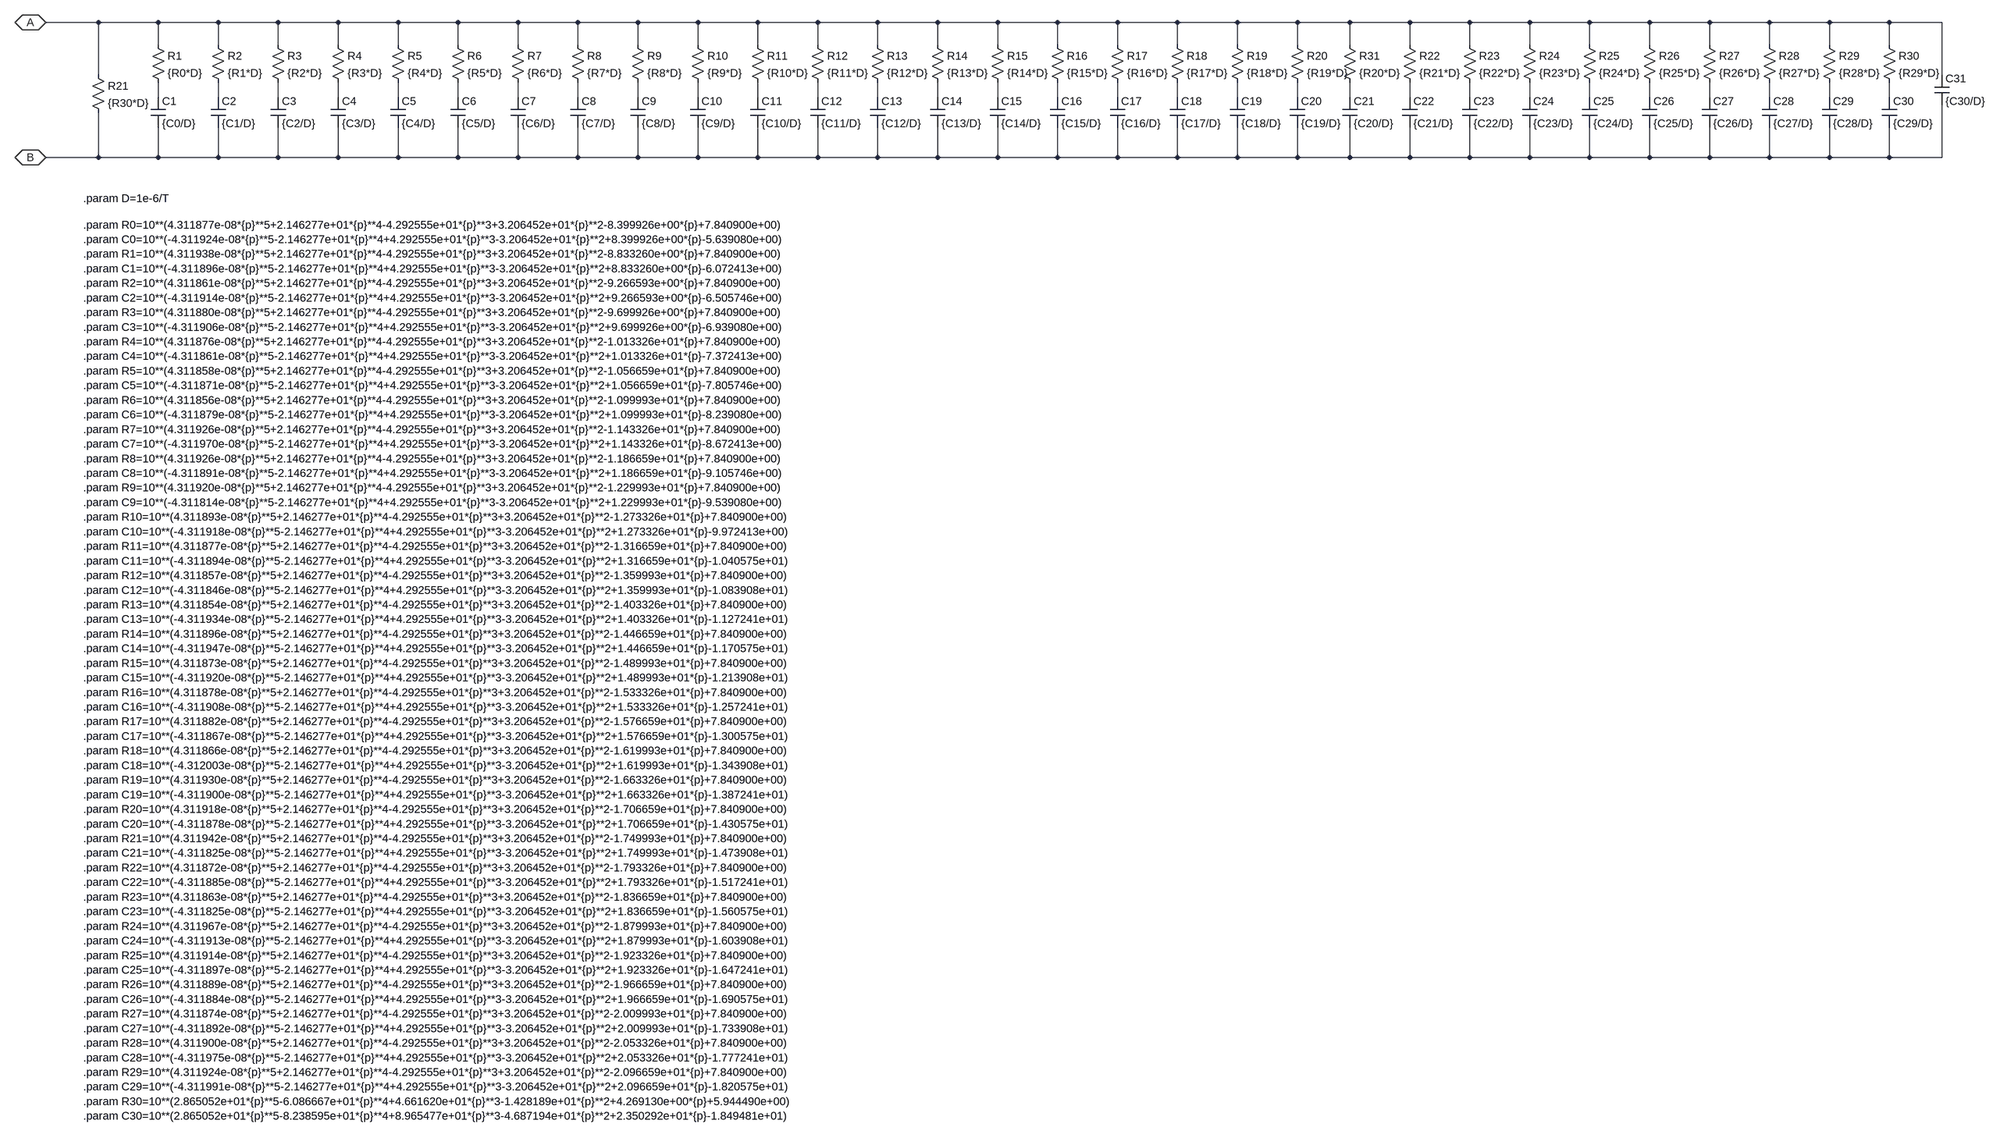
[diagram p0: schematic CPE_0.001_to_10e9.asc]
CPE_0.001_to_10e9.asc, the LTspice schematic file:
Version 4
SHEET 1 2676 1292
WIRE -1376 -864 -1488 -864
WIRE -1248 -864 -1376 -864
WIRE -1120 -864 -1248 -864
WIRE -992 -864 -1120 -864
WIRE -864 -864 -992 -864
WIRE -736 -864 -864 -864
WIRE -608 -864 -736 -864
WIRE -480 -864 -608 -864
WIRE -352 -864 -480 -864
WIRE -224 -864 -352 -864
WIRE -96 -864 -224 -864
WIRE 32 -864 -96 -864
WIRE 160 -864 32 -864
WIRE 288 -864 160 -864
WIRE 416 -864 288 -864
WIRE 544 -864 416 -864
WIRE 672 -864 544 -864
WIRE 800 -864 672 -864
WIRE 928 -864 800 -864
WIRE 1056 -864 928 -864
WIRE 1184 -864 1056 -864
WIRE 1296 -864 1184 -864
WIRE 1424 -864 1296 -864
WIRE 1552 -864 1424 -864
WIRE 1680 -864 1552 -864
WIRE 1808 -864 1680 -864
WIRE 1936 -864 1808 -864
WIRE 2064 -864 1936 -864
WIRE 2192 -864 2064 -864
WIRE 2320 -864 2192 -864
WIRE 2448 -864 2320 -864
WIRE 2560 -864 2448 -864
WIRE -1248 -816 -1248 -864
WIRE -1120 -816 -1120 -864
WIRE -992 -816 -992 -864
WIRE -864 -816 -864 -864
WIRE -736 -816 -736 -864
WIRE -608 -816 -608 -864
WIRE -480 -816 -480 -864
WIRE -352 -816 -352 -864
WIRE -224 -816 -224 -864
WIRE -96 -816 -96 -864
WIRE 32 -816 32 -864
WIRE 160 -816 160 -864
WIRE 288 -816 288 -864
WIRE 416 -816 416 -864
WIRE 544 -816 544 -864
WIRE 672 -816 672 -864
WIRE 800 -816 800 -864
WIRE 928 -816 928 -864
WIRE 1056 -816 1056 -864
WIRE 1184 -816 1184 -864
WIRE 1296 -816 1296 -864
WIRE 1424 -816 1424 -864
WIRE 1552 -816 1552 -864
WIRE 1680 -816 1680 -864
WIRE 1808 -816 1808 -864
WIRE 1936 -816 1936 -864
WIRE 2064 -816 2064 -864
WIRE 2192 -816 2192 -864
WIRE 2320 -816 2320 -864
WIRE 2448 -816 2448 -864
WIRE -1376 -752 -1376 -864
WIRE 2560 -752 2560 -864
WIRE -1248 -704 -1248 -736
WIRE -1120 -704 -1120 -736
WIRE -992 -704 -992 -736
WIRE -864 -704 -864 -736
WIRE -736 -704 -736 -736
WIRE -608 -704 -608 -736
WIRE -480 -704 -480 -736
WIRE -352 -704 -352 -736
WIRE -224 -704 -224 -736
WIRE -96 -704 -96 -736
WIRE 32 -704 32 -736
WIRE 160 -704 160 -736
WIRE 288 -704 288 -736
WIRE 416 -704 416 -736
WIRE 544 -704 544 -736
WIRE 672 -704 672 -736
WIRE 800 -704 800 -736
WIRE 928 -704 928 -736
WIRE 1056 -704 1056 -736
WIRE 1184 -704 1184 -736
WIRE 1296 -704 1296 -736
WIRE 1424 -704 1424 -736
WIRE 1552 -704 1552 -736
WIRE 1680 -704 1680 -736
WIRE 1808 -704 1808 -736
WIRE 1936 -704 1936 -736
WIRE 2064 -704 2064 -736
WIRE 2192 -704 2192 -736
WIRE 2320 -704 2320 -736
WIRE 2448 -704 2448 -736
WIRE -1376 -576 -1376 -672
WIRE -1376 -576 -1488 -576
WIRE -1248 -576 -1248 -640
WIRE -1248 -576 -1376 -576
WIRE -1120 -576 -1120 -640
WIRE -1120 -576 -1248 -576
WIRE -992 -576 -992 -640
WIRE -992 -576 -1120 -576
WIRE -864 -576 -864 -640
WIRE -864 -576 -992 -576
WIRE -736 -576 -736 -640
WIRE -736 -576 -864 -576
WIRE -608 -576 -608 -640
WIRE -608 -576 -736 -576
WIRE -480 -576 -480 -640
WIRE -480 -576 -608 -576
WIRE -352 -576 -352 -640
WIRE -352 -576 -480 -576
WIRE -224 -576 -224 -640
WIRE -224 -576 -352 -576
WIRE -96 -576 -96 -640
WIRE -96 -576 -224 -576
WIRE 32 -576 32 -640
WIRE 32 -576 -96 -576
WIRE 160 -576 160 -640
WIRE 160 -576 32 -576
WIRE 288 -576 288 -640
WIRE 288 -576 160 -576
WIRE 416 -576 416 -640
WIRE 416 -576 288 -576
WIRE 544 -576 544 -640
WIRE 544 -576 416 -576
WIRE 672 -576 672 -640
WIRE 672 -576 544 -576
WIRE 800 -576 800 -640
WIRE 800 -576 672 -576
WIRE 928 -576 928 -640
WIRE 928 -576 800 -576
WIRE 1056 -576 1056 -640
WIRE 1056 -576 928 -576
WIRE 1184 -576 1184 -640
WIRE 1184 -576 1056 -576
WIRE 1296 -576 1296 -640
WIRE 1296 -576 1184 -576
WIRE 1424 -576 1424 -640
WIRE 1424 -576 1296 -576
WIRE 1552 -576 1552 -640
WIRE 1552 -576 1424 -576
WIRE 1680 -576 1680 -640
WIRE 1680 -576 1552 -576
WIRE 1808 -576 1808 -640
WIRE 1808 -576 1680 -576
WIRE 1936 -576 1936 -640
WIRE 1936 -576 1808 -576
WIRE 2064 -576 2064 -640
WIRE 2064 -576 1936 -576
WIRE 2192 -576 2192 -640
WIRE 2192 -576 2064 -576
WIRE 2320 -576 2320 -640
WIRE 2320 -576 2192 -576
WIRE 2448 -576 2448 -640
WIRE 2448 -576 2320 -576
WIRE 2560 -576 2560 -688
WIRE 2560 -576 2448 -576
FLAG -1488 -576 B
IOPIN -1488 -576 BiDir
FLAG -1488 -864 A
IOPIN -1488 -864 BiDir
SYMBOL cap -1264 -704 R0
SYMATTR InstName C1
SYMATTR Value {C0/D}
SYMBOL res -1264 -832 R0
SYMATTR InstName R1
SYMATTR Value {R0*D}
SYMBOL cap -1136 -704 R0
SYMATTR InstName C2
SYMATTR Value {C1/D}
SYMBOL res -1136 -832 R0
SYMATTR InstName R2
SYMATTR Value {R1*D}
SYMBOL cap -1008 -704 R0
SYMATTR InstName C3
SYMATTR Value {C2/D}
SYMBOL res -1008 -832 R0
SYMATTR InstName R3
SYMATTR Value {R2*D}
SYMBOL cap -880 -704 R0
SYMATTR InstName C4
SYMATTR Value {C3/D}
SYMBOL res -880 -832 R0
SYMATTR InstName R4
SYMATTR Value {R3*D}
SYMBOL cap -752 -704 R0
SYMATTR InstName C5
SYMATTR Value {C4/D}
SYMBOL res -752 -832 R0
SYMATTR InstName R5
SYMATTR Value {R4*D}
SYMBOL cap -624 -704 R0
SYMATTR InstName C6
SYMATTR Value {C5/D}
SYMBOL res -624 -832 R0
SYMATTR InstName R6
SYMATTR Value {R5*D}
SYMBOL cap -496 -704 R0
SYMATTR InstName C7
SYMATTR Value {C6/D}
SYMBOL res -496 -832 R0
SYMATTR InstName R7
SYMATTR Value {R6*D}
SYMBOL cap -368 -704 R0
SYMATTR InstName C8
SYMATTR Value {C7/D}
SYMBOL res -368 -832 R0
SYMATTR InstName R8
SYMATTR Value {R7*D}
SYMBOL cap -240 -704 R0
SYMATTR InstName C9
SYMATTR Value {C8/D}
SYMBOL res -240 -832 R0
SYMATTR InstName R9
SYMATTR Value {R8*D}
SYMBOL cap -112 -704 R0
SYMATTR InstName C10
SYMATTR Value {C9/D}
SYMBOL res -112 -832 R0
SYMATTR InstName R10
SYMATTR Value {R9*D}
SYMBOL cap 16 -704 R0
SYMATTR InstName C11
SYMATTR Value {C10/D}
SYMBOL res 16 -832 R0
SYMATTR InstName R11
SYMATTR Value {R10*D}
SYMBOL cap 144 -704 R0
SYMATTR InstName C12
SYMATTR Value {C11/D}
SYMBOL res 144 -832 R0
SYMATTR InstName R12
SYMATTR Value {R11*D}
SYMBOL cap 272 -704 R0
SYMATTR InstName C13
SYMATTR Value {C12/D}
SYMBOL res 272 -832 R0
SYMATTR InstName R13
SYMATTR Value {R12*D}
SYMBOL cap 400 -704 R0
SYMATTR InstName C14
SYMATTR Value {C13/D}
SYMBOL res 400 -832 R0
SYMATTR InstName R14
SYMATTR Value {R13*D}
SYMBOL cap 528 -704 R0
SYMATTR InstName C15
SYMATTR Value {C14/D}
SYMBOL res 528 -832 R0
SYMATTR InstName R15
SYMATTR Value {R14*D}
SYMBOL cap 656 -704 R0
SYMATTR InstName C16
SYMATTR Value {C15/D}
SYMBOL res 656 -832 R0
SYMATTR InstName R16
SYMATTR Value {R15*D}
SYMBOL cap 784 -704 R0
SYMATTR InstName C17
SYMATTR Value {C16/D}
SYMBOL res 784 -832 R0
SYMATTR InstName R17
SYMATTR Value {R16*D}
SYMBOL cap 912 -704 R0
SYMATTR InstName C18
SYMATTR Value {C17/D}
SYMBOL res 912 -832 R0
SYMATTR InstName R18
SYMATTR Value {R17*D}
SYMBOL cap 1040 -704 R0
SYMATTR InstName C19
SYMATTR Value {C18/D}
SYMBOL res 1040 -832 R0
SYMATTR InstName R19
SYMATTR Value {R18*D}
SYMBOL cap 1168 -704 R0
SYMATTR InstName C20
SYMATTR Value {C19/D}
SYMBOL res 1168 -832 R0
SYMATTR InstName R20
SYMATTR Value {R19*D}
SYMBOL res -1392 -768 R0
SYMATTR InstName R21
SYMATTR Value {R30*D}
SYMBOL cap 1408 -704 R0
SYMATTR InstName C22
SYMATTR Value {C21/D}
SYMBOL res 1408 -832 R0
SYMATTR InstName R22
SYMATTR Value {R21*D}
SYMBOL cap 1536 -704 R0
SYMATTR InstName C23
SYMATTR Value {C22/D}
SYMBOL res 1536 -832 R0
SYMATTR InstName R23
SYMATTR Value {R22*D}
SYMBOL cap 1664 -704 R0
SYMATTR InstName C24
SYMATTR Value {C23/D}
SYMBOL res 1664 -832 R0
SYMATTR InstName R24
SYMATTR Value {R23*D}
SYMBOL cap 1792 -704 R0
SYMATTR InstName C25
SYMATTR Value {C24/D}
SYMBOL res 1792 -832 R0
SYMATTR InstName R25
SYMATTR Value {R24*D}
SYMBOL cap 1920 -704 R0
SYMATTR InstName C26
SYMATTR Value {C25/D}
SYMBOL res 1920 -832 R0
SYMATTR InstName R26
SYMATTR Value {R25*D}
SYMBOL cap 2048 -704 R0
SYMATTR InstName C27
SYMATTR Value {C26/D}
SYMBOL res 2048 -832 R0
SYMATTR InstName R27
SYMATTR Value {R26*D}
SYMBOL cap 2176 -704 R0
SYMATTR InstName C28
SYMATTR Value {C27/D}
SYMBOL res 2176 -832 R0
SYMATTR InstName R28
SYMATTR Value {R27*D}
SYMBOL cap 2304 -704 R0
SYMATTR InstName C29
SYMATTR Value {C28/D}
SYMBOL res 2304 -832 R0
SYMATTR InstName R29
SYMATTR Value {R28*D}
SYMBOL cap 2432 -704 R0
SYMATTR InstName C30
SYMATTR Value {C29/D}
SYMBOL res 2432 -832 R0
SYMATTR InstName R30
SYMATTR Value {R29*D}
SYMBOL cap 2544 -752 R0
SYMATTR InstName C31
SYMATTR Value {C30/D}
SYMBOL cap 1280 -704 R0
SYMATTR InstName C21
SYMATTR Value {C20/D}
SYMBOL res 1280 -832 R0
SYMATTR InstName R31
SYMATTR Value {R20*D}
TEXT -1408 -488 Left 2 !.param D=1e-6/T
TEXT -1408 -432 Left 2 !.param R0=10**(4.311877e-08*{p}**5+2.146277e+01*{p}**4-4.292555e+01*{p}**3+3.206452e+01*{p}**2-8.399926e+00*{p}+7.840900e+00)\n.param C0=10**(-4.311924e-08*{p}**5-2.146277e+01*{p}**4+4.292555e+01*{p}**3-3.206452e+01*{p}**2+8.399926e+00*{p}-5.639080e+00)\n.param R1=10**(4.311938e-08*{p}**5+2.146277e+01*{p}**4-4.292555e+01*{p}**3+3.206452e+01*{p}**2-8.833260e+00*{p}+7.840900e+00)\n.param C1=10**(-4.311896e-08*{p}**5-2.146277e+01*{p}**4+4.292555e+01*{p}**3-3.206452e+01*{p}**2+8.833260e+00*{p}-6.072413e+00)\n.param R2=10**(4.311861e-08*{p}**5+2.146277e+01*{p}**4-4.292555e+01*{p}**3+3.206452e+01*{p}**2-9.266593e+00*{p}+7.840900e+00)\n.param C2=10**(-4.311914e-08*{p}**5-2.146277e+01*{p}**4+4.292555e+01*{p}**3-3.206452e+01*{p}**2+9.266593e+00*{p}-6.505746e+00)\n.param R3=10**(4.311880e-08*{p}**5+2.146277e+01*{p}**4-4.292555e+01*{p}**3+3.206452e+01*{p}**2-9.699926e+00*{p}+7.840900e+00)\n.param C3=10**(-4.311906e-08*{p}**5-2.146277e+01*{p}**4+4.292555e+01*{p}**3-3.206452e+01*{p}**2+9.699926e+00*{p}-6.939080e+00)\n.param R4=10**(4.311876e-08*{p}**5+2.146277e+01*{p}**4-4.292555e+01*{p}**3+3.206452e+01*{p}**2-1.013326e+01*{p}+7.840900e+00)\n.param C4=10**(-4.311861e-08*{p}**5-2.146277e+01*{p}**4+4.292555e+01*{p}**3-3.206452e+01*{p}**2+1.013326e+01*{p}-7.372413e+00)\n.param R5=10**(4.311858e-08*{p}**5+2.146277e+01*{p}**4-4.292555e+01*{p}**3+3.206452e+01*{p}**2-1.056659e+01*{p}+7.840900e+00)\n.param C5=10**(-4.311871e-08*{p}**5-2.146277e+01*{p}**4+4.292555e+01*{p}**3-3.206452e+01*{p}**2+1.056659e+01*{p}-7.805746e+00)\n.param R6=10**(4.311856e-08*{p}**5+2.146277e+01*{p}**4-4.292555e+01*{p}**3+3.206452e+01*{p}**2-1.099993e+01*{p}+7.840900e+00)\n.param C6=10**(-4.311879e-08*{p}**5-2.146277e+01*{p}**4+4.292555e+01*{p}**3-3.206452e+01*{p}**2+1.099993e+01*{p}-8.239080e+00)\n.param R7=10**(4.311926e-08*{p}**5+2.146277e+01*{p}**4-4.292555e+01*{p}**3+3.206452e+01*{p}**2-1.143326e+01*{p}+7.840900e+00)\n.param C7=10**(-4.311970e-08*{p}**5-2.146277e+01*{p}**4+4.292555e+01*{p}**3-3.206452e+01*{p}**2+1.143326e+01*{p}-8.672413e+00)\n.param R8=10**(4.311926e-08*{p}**5+2.146277e+01*{p}**4-4.292555e+01*{p}**3+3.206452e+01*{p}**2-1.186659e+01*{p}+7.840900e+00)\n.param C8=10**(-4.311891e-08*{p}**5-2.146277e+01*{p}**4+4.292555e+01*{p}**3-3.206452e+01*{p}**2+1.186659e+01*{p}-9.105746e+00)\n.param R9=10**(4.311920e-08*{p}**5+2.146277e+01*{p}**4-4.292555e+01*{p}**3+3.206452e+01*{p}**2-1.229993e+01*{p}+7.840900e+00)\n.param C9=10**(-4.311814e-08*{p}**5-2.146277e+01*{p}**4+4.292555e+01*{p}**3-3.206452e+01*{p}**2+1.229993e+01*{p}-9.539080e+00)\n.param R10=10**(4.311893e-08*{p}**5+2.146277e+01*{p}**4-4.292555e+01*{p}**3+3.206452e+01*{p}**2-1.273326e+01*{p}+7.840900e+00)\n.param C10=10**(-4.311918e-08*{p}**5-2.146277e+01*{p}**4+4.292555e+01*{p}**3-3.206452e+01*{p}**2+1.273326e+01*{p}-9.972413e+00)\n.param R11=10**(4.311877e-08*{p}**5+2.146277e+01*{p}**4-4.292555e+01*{p}**3+3.206452e+01*{p}**2-1.316659e+01*{p}+7.840900e+00)\n.param C11=10**(-4.311894e-08*{p}**5-2.146277e+01*{p}**4+4.292555e+01*{p}**3-3.206452e+01*{p}**2+1.316659e+01*{p}-1.040575e+01)\n.param R12=10**(4.311857e-08*{p}**5+2.146277e+01*{p}**4-4.292555e+01*{p}**3+3.206452e+01*{p}**2-1.359993e+01*{p}+7.840900e+00)\n.param C12=10**(-4.311846e-08*{p}**5-2.146277e+01*{p}**4+4.292555e+01*{p}**3-3.206452e+01*{p}**2+1.359993e+01*{p}-1.083908e+01)\n.param R13=10**(4.311854e-08*{p}**5+2.146277e+01*{p}**4-4.292555e+01*{p}**3+3.206452e+01*{p}**2-1.403326e+01*{p}+7.840900e+00)\n.param C13=10**(-4.311934e-08*{p}**5-2.146277e+01*{p}**4+4.292555e+01*{p}**3-3.206452e+01*{p}**2+1.403326e+01*{p}-1.127241e+01)\n.param R14=10**(4.311896e-08*{p}**5+2.146277e+01*{p}**4-4.292555e+01*{p}**3+3.206452e+01*{p}**2-1.446659e+01*{p}+7.840900e+00)\n.param C14=10**(-4.311947e-08*{p}**5-2.146277e+01*{p}**4+4.292555e+01*{p}**3-3.206452e+01*{p}**2+1.446659e+01*{p}-1.170575e+01)\n.param R15=10**(4.311873e-08*{p}**5+2.146277e+01*{p}**4-4.292555e+01*{p}**3+3.206452e+01*{p}**2-1.489993e+01*{p}+7.840900e+00)\n.param C15=10**(-4.311920e-08*{p}**5-2.146277e+01*{p}**4+4.292555e+01*{p}**3-3.206452e+01*{p}**2+1.489993e+01*{p}-1.213908e+01)\n.param R16=10**(4.311878e-08*{p}**5+2.146277e+01*{p}**4-4.292555e+01*{p}**3+3.206452e+01*{p}**2-1.533326e+01*{p}+7.840900e+00)\n.param C16=10**(-4.311908e-08*{p}**5-2.146277e+01*{p}**4+4.292555e+01*{p}**3-3.206452e+01*{p}**2+1.533326e+01*{p}-1.257241e+01)\n.param R17=10**(4.311882e-08*{p}**5+2.146277e+01*{p}**4-4.292555e+01*{p}**3+3.206452e+01*{p}**2-1.576659e+01*{p}+7.840900e+00)\n.param C17=10**(-4.311867e-08*{p}**5-2.146277e+01*{p}**4+4.292555e+01*{p}**3-3.206452e+01*{p}**2+1.576659e+01*{p}-1.300575e+01)\n.param R18=10**(4.311866e-08*{p}**5+2.146277e+01*{p}**4-4.292555e+01*{p}**3+3.206452e+01*{p}**2-1.619993e+01*{p}+7.840900e+00)\n.param C18=10**(-4.312003e-08*{p}**5-2.146277e+01*{p}**4+4.292555e+01*{p}**3-3.206452e+01*{p}**2+1.619993e+01*{p}-1.343908e+01)\n.param R19=10**(4.311930e-08*{p}**5+2.146277e+01*{p}**4-4.292555e+01*{p}**3+3.206452e+01*{p}**2-1.663326e+01*{p}+7.840900e+00)\n.param C19=10**(-4.311900e-08*{p}**5-2.146277e+01*{p}**4+4.292555e+01*{p}**3-3.206452e+01*{p}**2+1.663326e+01*{p}-1.387241e+01)\n.param R20=10**(4.311918e-08*{p}**5+2.146277e+01*{p}**4-4.292555e+01*{p}**3+3.206452e+01*{p}**2-1.706659e+01*{p}+7.840900e+00)\n.param C20=10**(-4.311878e-08*{p}**5-2.146277e+01*{p}**4+4.292555e+01*{p}**3-3.206452e+01*{p}**2+1.706659e+01*{p}-1.430575e+01)\n.param R21=10**(4.311942e-08*{p}**5+2.146277e+01*{p}**4-4.292555e+01*{p}**3+3.206452e+01*{p}**2-1.749993e+01*{p}+7.840900e+00)\n.param C21=10**(-4.311825e-08*{p}**5-2.146277e+01*{p}**4+4.292555e+01*{p}**3-3.206452e+01*{p}**2+1.749993e+01*{p}-1.473908e+01)\n.param R22=10**(4.311872e-08*{p}**5+2.146277e+01*{p}**4-4.292555e+01*{p}**3+3.206452e+01*{p}**2-1.793326e+01*{p}+7.840900e+00)\n.param C22=10**(-4.311885e-08*{p}**5-2.146277e+01*{p}**4+4.292555e+01*{p}**3-3.206452e+01*{p}**2+1.793326e+01*{p}-1.517241e+01)\n.param R23=10**(4.311863e-08*{p}**5+2.146277e+01*{p}**4-4.292555e+01*{p}**3+3.206452e+01*{p}**2-1.836659e+01*{p}+7.840900e+00)\n.param C23=10**(-4.311825e-08*{p}**5-2.146277e+01*{p}**4+4.292555e+01*{p}**3-3.206452e+01*{p}**2+1.836659e+01*{p}-1.560575e+01)\n.param R24=10**(4.311967e-08*{p}**5+2.146277e+01*{p}**4-4.292555e+01*{p}**3+3.206452e+01*{p}**2-1.879993e+01*{p}+7.840900e+00)\n.param C24=10**(-4.311913e-08*{p}**5-2.146277e+01*{p}**4+4.292555e+01*{p}**3-3.206452e+01*{p}**2+1.879993e+01*{p}-1.603908e+01)\n.param R25=10**(4.311914e-08*{p}**5+2.146277e+01*{p}**4-4.292555e+01*{p}**3+3.206452e+01*{p}**2-1.923326e+01*{p}+7.840900e+00)\n.param C25=10**(-4.311897e-08*{p}**5-2.146277e+01*{p}**4+4.292555e+01*{p}**3-3.206452e+01*{p}**2+1.923326e+01*{p}-1.647241e+01)\n.param R26=10**(4.311889e-08*{p}**5+2.146277e+01*{p}**4-4.292555e+01*{p}**3+3.206452e+01*{p}**2-1.966659e+01*{p}+7.840900e+00)\n.param C26=10**(-4.311884e-08*{p}**5-2.146277e+01*{p}**4+4.292555e+01*{p}**3-3.206452e+01*{p}**2+1.966659e+01*{p}-1.690575e+01)\n.param R27=10**(4.311874e-08*{p}**5+2.146277e+01*{p}**4-4.292555e+01*{p}**3+3.206452e+01*{p}**2-2.009993e+01*{p}+7.840900e+00)\n.param C27=10**(-4.311892e-08*{p}**5-2.146277e+01*{p}**4+4.292555e+01*{p}**3-3.206452e+01*{p}**2+2.009993e+01*{p}-1.733908e+01)\n.param R28=10**(4.311900e-08*{p}**5+2.146277e+01*{p}**4-4.292555e+01*{p}**3+3.206452e+01*{p}**2-2.053326e+01*{p}+7.840900e+00)\n.param C28=10**(-4.311975e-08*{p}**5-2.146277e+01*{p}**4+4.292555e+01*{p}**3-3.206452e+01*{p}**2+2.053326e+01*{p}-1.777241e+01)\n.param R29=10**(4.311924e-08*{p}**5+2.146277e+01*{p}**4-4.292555e+01*{p}**3+3.206452e+01*{p}**2-2.096659e+01*{p}+7.840900e+00)\n.param C29=10**(-4.311991e-08*{p}**5-2.146277e+01*{p}**4+4.292555e+01*{p}**3-3.206452e+01*{p}**2+2.096659e+01*{p}-1.820575e+01)\n.param R30=10**(2.865052e+01*{p}**5-6.086667e+01*{p}**4+4.661620e+01*{p}**3-1.428189e+01*{p}**2+4.269130e+00*{p}+5.944490e+00)\n.param C30=10**(2.865052e+01*{p}**5-8.238595e+01*{p}**4+8.965477e+01*{p}**3-4.687194e+01*{p}**2+2.350292e+01*{p}-1.849481e+01)

The netlist it stands for:
* CPE_0.001_to_10e9.asc
C1 N001 B {C0/D}
R1 A N001 {R0*D}
C2 N002 B {C1/D}
R2 A N002 {R1*D}
C3 N003 B {C2/D}
R3 A N003 {R2*D}
C4 N004 B {C3/D}
R4 A N004 {R3*D}
C5 N005 B {C4/D}
R5 A N005 {R4*D}
C6 N006 B {C5/D}
R6 A N006 {R5*D}
C7 N007 B {C6/D}
R7 A N007 {R6*D}
C8 N008 B {C7/D}
R8 A N008 {R7*D}
C9 N009 B {C8/D}
R9 A N009 {R8*D}
C10 N010 B {C9/D}
R10 A N010 {R9*D}
C11 N011 B {C10/D}
R11 A N011 {R10*D}
C12 N012 B {C11/D}
R12 A N012 {R11*D}
C13 N013 B {C12/D}
R13 A N013 {R12*D}
C14 N014 B {C13/D}
R14 A N014 {R13*D}
C15 N015 B {C14/D}
R15 A N015 {R14*D}
C16 N016 B {C15/D}
R16 A N016 {R15*D}
C17 N017 B {C16/D}
R17 A N017 {R16*D}
C18 N018 B {C17/D}
R18 A N018 {R17*D}
C19 N019 B {C18/D}
R19 A N019 {R18*D}
C20 N020 B {C19/D}
R20 A N020 {R19*D}
R21 A B {R30*D}
C22 N022 B {C21/D}
R22 A N022 {R21*D}
C23 N023 B {C22/D}
R23 A N023 {R22*D}
C24 N024 B {C23/D}
R24 A N024 {R23*D}
C25 N025 B {C24/D}
R25 A N025 {R24*D}
C26 N026 B {C25/D}
R26 A N026 {R25*D}
C27 N027 B {C26/D}
R27 A N027 {R26*D}
C28 N028 B {C27/D}
R28 A N028 {R27*D}
C29 N029 B {C28/D}
R29 A N029 {R28*D}
C30 N030 B {C29/D}
R30 A N030 {R29*D}
C31 A B {C30/D}
C21 N021 B {C20/D}
R31 A N021 {R20*D}
.param D=1e-6/T
.param R0=10**(4.311877e-08*{p}**5+2.146277e+01*{p}**4-4.292555e+01*{p}**3+3.206452e+01*{p}**2-8.399926e+00*{p}+7.840900e+00)
.param C0=10**(-4.311924e-08*{p}**5-2.146277e+01*{p}**4+4.292555e+01*{p}**3-3.206452e+01*{p}**2+8.399926e+00*{p}-5.639080e+00)
.param R1=10**(4.311938e-08*{p}**5+2.146277e+01*{p}**4-4.292555e+01*{p}**3+3.206452e+01*{p}**2-8.833260e+00*{p}+7.840900e+00)
.param C1=10**(-4.311896e-08*{p}**5-2.146277e+01*{p}**4+4.292555e+01*{p}**3-3.206452e+01*{p}**2+8.833260e+00*{p}-6.072413e+00)
.param R2=10**(4.311861e-08*{p}**5+2.146277e+01*{p}**4-4.292555e+01*{p}**3+3.206452e+01*{p}**2-9.266593e+00*{p}+7.840900e+00)
.param C2=10**(-4.311914e-08*{p}**5-2.146277e+01*{p}**4+4.292555e+01*{p}**3-3.206452e+01*{p}**2+9.266593e+00*{p}-6.505746e+00)
.param R3=10**(4.311880e-08*{p}**5+2.146277e+01*{p}**4-4.292555e+01*{p}**3+3.206452e+01*{p}**2-9.699926e+00*{p}+7.840900e+00)
.param C3=10**(-4.311906e-08*{p}**5-2.146277e+01*{p}**4+4.292555e+01*{p}**3-3.206452e+01*{p}**2+9.699926e+00*{p}-6.939080e+00)
.param R4=10**(4.311876e-08*{p}**5+2.146277e+01*{p}**4-4.292555e+01*{p}**3+3.206452e+01*{p}**2-1.013326e+01*{p}+7.840900e+00)
.param C4=10**(-4.311861e-08*{p}**5-2.146277e+01*{p}**4+4.292555e+01*{p}**3-3.206452e+01*{p}**2+1.013326e+01*{p}-7.372413e+00)
.param R5=10**(4.311858e-08*{p}**5+2.146277e+01*{p}**4-4.292555e+01*{p}**3+3.206452e+01*{p}**2-1.056659e+01*{p}+7.840900e+00)
.param C5=10**(-4.311871e-08*{p}**5-2.146277e+01*{p}**4+4.292555e+01*{p}**3-3.206452e+01*{p}**2+1.056659e+01*{p}-7.805746e+00)
.param R6=10**(4.311856e-08*{p}**5+2.146277e+01*{p}**4-4.292555e+01*{p}**3+3.206452e+01*{p}**2-1.099993e+01*{p}+7.840900e+00)
.param C6=10**(-4.311879e-08*{p}**5-2.146277e+01*{p}**4+4.292555e+01*{p}**3-3.206452e+01*{p}**2+1.099993e+01*{p}-8.239080e+00)
.param R7=10**(4.311926e-08*{p}**5+2.146277e+01*{p}**4-4.292555e+01*{p}**3+3.206452e+01*{p}**2-1.143326e+01*{p}+7.840900e+00)
.param C7=10**(-4.311970e-08*{p}**5-2.146277e+01*{p}**4+4.292555e+01*{p}**3-3.206452e+01*{p}**2+1.143326e+01*{p}-8.672413e+00)
.param R8=10**(4.311926e-08*{p}**5+2.146277e+01*{p}**4-4.292555e+01*{p}**3+3.206452e+01*{p}**2-1.186659e+01*{p}+7.840900e+00)
.param C8=10**(-4.311891e-08*{p}**5-2.146277e+01*{p}**4+4.292555e+01*{p}**3-3.206452e+01*{p}**2+1.186659e+01*{p}-9.105746e+00)
.param R9=10**(4.311920e-08*{p}**5+2.146277e+01*{p}**4-4.292555e+01*{p}**3+3.206452e+01*{p}**2-1.229993e+01*{p}+7.840900e+00)
.param C9=10**(-4.311814e-08*{p}**5-2.146277e+01*{p}**4+4.292555e+01*{p}**3-3.206452e+01*{p}**2+1.229993e+01*{p}-9.539080e+00)
.param R10=10**(4.311893e-08*{p}**5+2.146277e+01*{p}**4-4.292555e+01*{p}**3+3.206452e+01*{p}**2-1.273326e+01*{p}+7.840900e+00)
.param C10=10**(-4.311918e-08*{p}**5-2.146277e+01*{p}**4+4.292555e+01*{p}**3-3.206452e+01*{p}**2+1.273326e+01*{p}-9.972413e+00)
.param R11=10**(4.311877e-08*{p}**5+2.146277e+01*{p}**4-4.292555e+01*{p}**3+3.206452e+01*{p}**2-1.316659e+01*{p}+7.840900e+00)
.param C11=10**(-4.311894e-08*{p}**5-2.146277e+01*{p}**4+4.292555e+01*{p}**3-3.206452e+01*{p}**2+1.316659e+01*{p}-1.040575e+01)
.param R12=10**(4.311857e-08*{p}**5+2.146277e+01*{p}**4-4.292555e+01*{p}**3+3.206452e+01*{p}**2-1.359993e+01*{p}+7.840900e+00)
.param C12=10**(-4.311846e-08*{p}**5-2.146277e+01*{p}**4+4.292555e+01*{p}**3-3.206452e+01*{p}**2+1.359993e+01*{p}-1.083908e+01)
.param R13=10**(4.311854e-08*{p}**5+2.146277e+01*{p}**4-4.292555e+01*{p}**3+3.206452e+01*{p}**2-1.403326e+01*{p}+7.840900e+00)
.param C13=10**(-4.311934e-08*{p}**5-2.146277e+01*{p}**4+4.292555e+01*{p}**3-3.206452e+01*{p}**2+1.403326e+01*{p}-1.127241e+01)
.param R14=10**(4.311896e-08*{p}**5+2.146277e+01*{p}**4-4.292555e+01*{p}**3+3.206452e+01*{p}**2-1.446659e+01*{p}+7.840900e+00)
.param C14=10**(-4.311947e-08*{p}**5-2.146277e+01*{p}**4+4.292555e+01*{p}**3-3.206452e+01*{p}**2+1.446659e+01*{p}-1.170575e+01)
.param R15=10**(4.311873e-08*{p}**5+2.146277e+01*{p}**4-4.292555e+01*{p}**3+3.206452e+01*{p}**2-1.489993e+01*{p}+7.840900e+00)
.param C15=10**(-4.311920e-08*{p}**5-2.146277e+01*{p}**4+4.292555e+01*{p}**3-3.206452e+01*{p}**2+1.489993e+01*{p}-1.213908e+01)
.param R16=10**(4.311878e-08*{p}**5+2.146277e+01*{p}**4-4.292555e+01*{p}**3+3.206452e+01*{p}**2-1.533326e+01*{p}+7.840900e+00)
.param C16=10**(-4.311908e-08*{p}**5-2.146277e+01*{p}**4+4.292555e+01*{p}**3-3.206452e+01*{p}**2+1.533326e+01*{p}-1.257241e+01)
.param R17=10**(4.311882e-08*{p}**5+2.146277e+01*{p}**4-4.292555e+01*{p}**3+3.206452e+01*{p}**2-1.576659e+01*{p}+7.840900e+00)
.param C17=10**(-4.311867e-08*{p}**5-2.146277e+01*{p}**4+4.292555e+01*{p}**3-3.206452e+01*{p}**2+1.576659e+01*{p}-1.300575e+01)
.param R18=10**(4.311866e-08*{p}**5+2.146277e+01*{p}**4-4.292555e+01*{p}**3+3.206452e+01*{p}**2-1.619993e+01*{p}+7.840900e+00)
.param C18=10**(-4.312003e-08*{p}**5-2.146277e+01*{p}**4+4.292555e+01*{p}**3-3.206452e+01*{p}**2+1.619993e+01*{p}-1.343908e+01)
.param R19=10**(4.311930e-08*{p}**5+2.146277e+01*{p}**4-4.292555e+01*{p}**3+3.206452e+01*{p}**2-1.663326e+01*{p}+7.840900e+00)
.param C19=10**(-4.311900e-08*{p}**5-2.146277e+01*{p}**4+4.292555e+01*{p}**3-3.206452e+01*{p}**2+1.663326e+01*{p}-1.387241e+01)
.param R20=10**(4.311918e-08*{p}**5+2.146277e+01*{p}**4-4.292555e+01*{p}**3+3.206452e+01*{p}**2-1.706659e+01*{p}+7.840900e+00)
.param C20=10**(-4.311878e-08*{p}**5-2.146277e+01*{p}**4+4.292555e+01*{p}**3-3.206452e+01*{p}**2+1.706659e+01*{p}-1.430575e+01)
.param R21=10**(4.311942e-08*{p}**5+2.146277e+01*{p}**4-4.292555e+01*{p}**3+3.206452e+01*{p}**2-1.749993e+01*{p}+7.840900e+00)
.param C21=10**(-4.311825e-08*{p}**5-2.146277e+01*{p}**4+4.292555e+01*{p}**3-3.206452e+01*{p}**2+1.749993e+01*{p}-1.473908e+01)
.param R22=10**(4.311872e-08*{p}**5+2.146277e+01*{p}**4-4.292555e+01*{p}**3+3.206452e+01*{p}**2-1.793326e+01*{p}+7.840900e+00)
.param C22=10**(-4.311885e-08*{p}**5-2.146277e+01*{p}**4+4.292555e+01*{p}**3-3.206452e+01*{p}**2+1.793326e+01*{p}-1.517241e+01)
.param R23=10**(4.311863e-08*{p}**5+2.146277e+01*{p}**4-4.292555e+01*{p}**3+3.206452e+01*{p}**2-1.836659e+01*{p}+7.840900e+00)
.param C23=10**(-4.311825e-08*{p}**5-2.146277e+01*{p}**4+4.292555e+01*{p}**3-3.206452e+01*{p}**2+1.836659e+01*{p}-1.560575e+01)
.param R24=10**(4.311967e-08*{p}**5+2.146277e+01*{p}**4-4.292555e+01*{p}**3+3.206452e+01*{p}**2-1.879993e+01*{p}+7.840900e+00)
.param C24=10**(-4.311913e-08*{p}**5-2.146277e+01*{p}**4+4.292555e+01*{p}**3-3.206452e+01*{p}**2+1.879993e+01*{p}-1.603908e+01)
.param R25=10**(4.311914e-08*{p}**5+2.146277e+01*{p}**4-4.292555e+01*{p}**3+3.206452e+01*{p}**2-1.923326e+01*{p}+7.840900e+00)
.param C25=10**(-4.311897e-08*{p}**5-2.146277e+01*{p}**4+4.292555e+01*{p}**3-3.206452e+01*{p}**2+1.923326e+01*{p}-1.647241e+01)
.param R26=10**(4.311889e-08*{p}**5+2.146277e+01*{p}**4-4.292555e+01*{p}**3+3.206452e+01*{p}**2-1.966659e+01*{p}+7.840900e+00)
.param C26=10**(-4.311884e-08*{p}**5-2.146277e+01*{p}**4+4.292555e+01*{p}**3-3.206452e+01*{p}**2+1.966659e+01*{p}-1.690575e+01)
.param R27=10**(4.311874e-08*{p}**5+2.146277e+01*{p}**4-4.292555e+01*{p}**3+3.206452e+01*{p}**2-2.009993e+01*{p}+7.840900e+00)
.param C27=10**(-4.311892e-08*{p}**5-2.146277e+01*{p}**4+4.292555e+01*{p}**3-3.206452e+01*{p}**2+2.009993e+01*{p}-1.733908e+01)
.param R28=10**(4.311900e-08*{p}**5+2.146277e+01*{p}**4-4.292555e+01*{p}**3+3.206452e+01*{p}**2-2.053326e+01*{p}+7.840900e+00)
.param C28=10**(-4.311975e-08*{p}**5-2.146277e+01*{p}**4+4.292555e+01*{p}**3-3.206452e+01*{p}**2+2.053326e+01*{p}-1.777241e+01)
.param R29=10**(4.311924e-08*{p}**5+2.146277e+01*{p}**4-4.292555e+01*{p}**3+3.206452e+01*{p}**2-2.096659e+01*{p}+7.840900e+00)
.param C29=10**(-4.311991e-08*{p}**5-2.146277e+01*{p}**4+4.292555e+01*{p}**3-3.206452e+01*{p}**2+2.096659e+01*{p}-1.820575e+01)
.param R30=10**(2.865052e+01*{p}**5-6.086667e+01*{p}**4+4.661620e+01*{p}**3-1.428189e+01*{p}**2+4.269130e+00*{p}+5.944490e+00)
.param C30=10**(2.865052e+01*{p}**5-8.238595e+01*{p}**4+8.965477e+01*{p}**3-4.687194e+01*{p}**2+2.350292e+01*{p}-1.849481e+01)
.backanno
.end